# EAGLE design Grove - Multichannel Gas Sensor v1.0 (EAGLE 7.1.0)

## Sheet 1 of 2
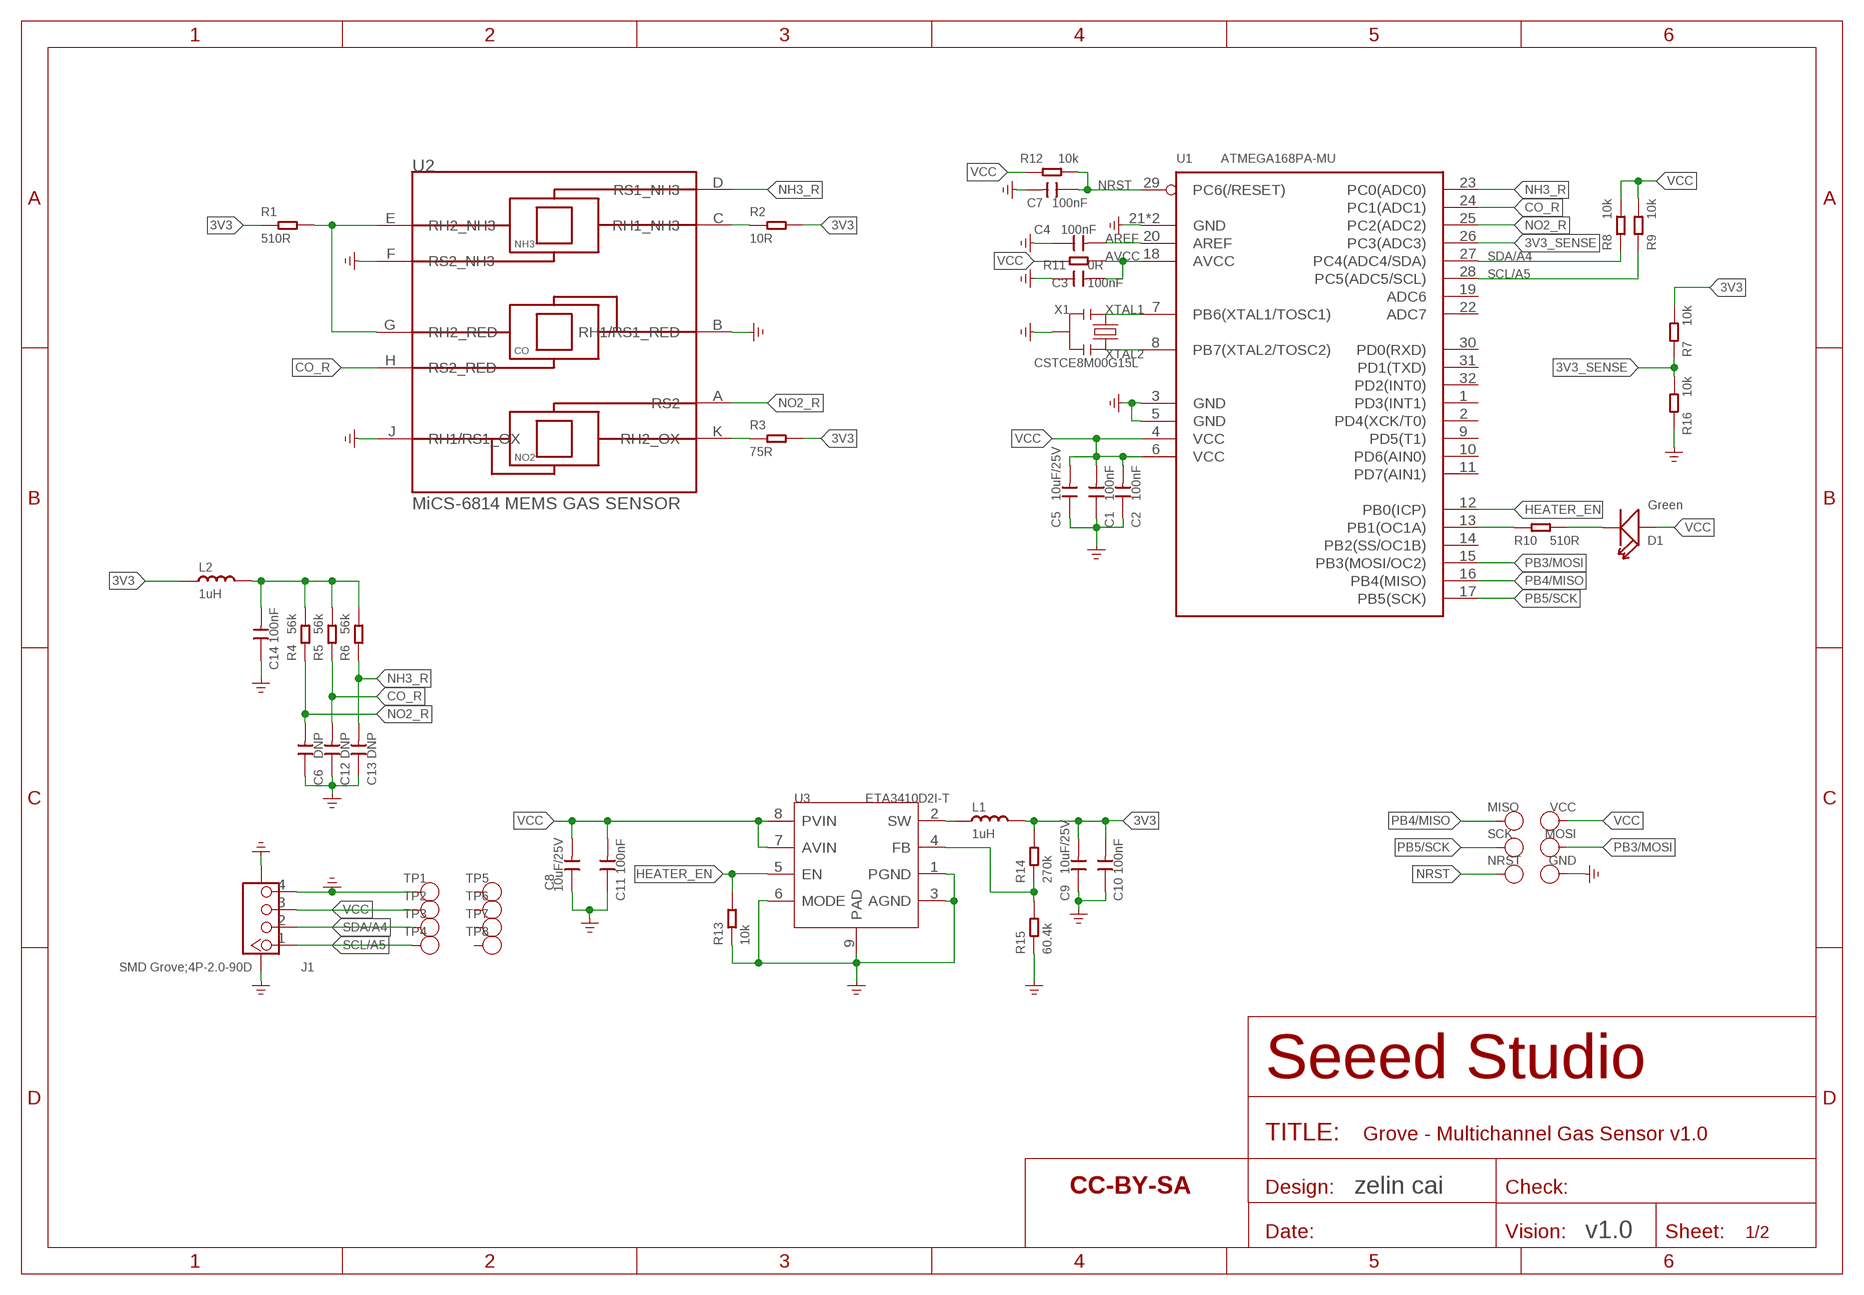
[diagram p0: schematic, sheet 1]

### Parts
C1  100nF  CAP-0402  [C0402]
C2  100nF  CAP-0402  [C0402]
C3  100nF  CAP-0402  [C0402]
C4  100nF  CAP-0402  [C0402]
C5  10uF/25V  CAP-0805  [C0805]
C6  DNP  CAP-0402  [C0402]
C7  100nF  CAP-0402  [C0402]
C8  10uF/25V  CAP-0805  [C0805]
C9  10uF/25V  CAP-0805  [C0805]
C10  100nF  CAP-0402  [C0402]
C11  100nF  CAP-0402  [C0402]
C12  DNP  CAP-0402  [C0402]
C13  DNP  CAP-0402  [C0402]
C14  100nF  CAP-0402  [C0402]
D1  Green  LED'0402'  [LED-0402]
GND  GND  TEST-POINT'4545'  [TP-D45MIL]
J1  SMD Grove;4P-2.0-90D  GROVE-CONNECTOR-SMD'90D'  [HW4-SMD-2.0-90D]
L1  1uH  INDUCTOR/FERRITE-BEAD'0603'  [L0603]
L2  1uH  INDUCTOR/FERRITE-BEAD'0603'  [L0603]
MISO  MISO  TEST-POINT'4545'  [TP-D45MIL]
MOSI  MOSI  TEST-POINT'4545'  [TP-D45MIL]
NRST  NRST  TEST-POINT'4545'  [TP-D45MIL]
R1  510R  RES-0402  [R0402]
R2  10R  RES-0402  [R0402]
R3  75R  RES-0402  [R0402]
R4  56k  RES-0402  [R0402]
R5  56k  RES-0402  [R0402]
R6  56k  RES-0402  [R0402]
R7  10k  RES-0402  [R0402]
R8  10k  RES-0402  [R0402]
R9  10k  RES-0402  [R0402]
R10  510R  RES-0402  [R0402]
R11  0R  RES-0402  [R0402]
R12  10k  RES-0402  [R0402]
R13  10k  RES-0402  [R0402]
R14  270k  RES-0402  [R0402]
R15  60.4k  RES-0402  [R0402]
R16  10k  RES-0402  [R0402]
SCK  SCK  TEST-POINT'4545'  [TP-D45MIL]
TP1  GND  TEST-POINT'4545'  [TP-D45MIL]
TP2  VCC  TEST-POINT'4545'  [TP-D45MIL]
TP3  SDA  TEST-POINT'4545'  [TP-D45MIL]
TP4  SCL  TEST-POINT'4545'  [TP-D45MIL]
TP5  NC  TEST-POINT'4545'  [TP-D45MIL]
TP6  NC  TEST-POINT'4545'  [TP-D45MIL]
TP7  NC  TEST-POINT'4545'  [TP-D45MIL]
TP8  NC  TEST-POINT'4545'  [TP-D45MIL]
U1  ATMEGA168PA-MU  MCU-ATMEGA8/168/328MU  [QFN32G-0.5-5X5MM]
U2  MiCS-6814  MICS-6814  [MICS-6814]
U3  ETA3410D2I-T  CONVERTER-ETA3410  [DFN8G-0.5-2X2MM]
U$1  Xadow-Multichanel Gas Sensor  SEEEDSTUDIO-OPEN-SCH-FRAME  [SEEEDSTUDIO-PCB-FRAME]
VCC  VCC  TEST-POINT'4545'  [TP-D45MIL]
X1  CSTCE8M00G15L  CRYSTAL-RESONATOR'SMD'  [RESONATOR3-SMD-3.6X1.3X0.8MM]

### Nets
3V3: C9.2 C10.2 L1.2 L2.1 R1.1 R2.2 R3.2 R7.1 R14.2
3V3_SENSE: R7.2 R16.1 U1.26(PC3(ADC3))
AREF: C4.2 U1.20(AREF)
AVCC: C3.2 R11.2 U1.18(AVCC)
CO_R: C12.2 R5.1 U1.24(PC1(ADC1)) U2.H(RS2_RED)
GND: C1.1 C2.1 C3.1 C4.1 C5.1 C6.1 C7.2 C8.1 C9.1 C10.1 C11.1 C12.1 C13.1 C14.1 GND.T J1.4 J1.SS1 J1.SS2 R13.1 R15.1 R16.2 TP1.T U1.3(GND) U1.5(GND) U1.21(GND) U1.33(GND) U2.B(RH1/RS1_RED) U2.F(RS2_NH3) U2.J(RH1/RS1_OX) U3.1(PGND) U3.3(AGND) U3.6(MODE) U3.9(PAD) X1.2 ; supply symbol labelled GND_POWER
HEATER_EN: R13.2 U1.12(PB0(ICP)) U3.5(EN)
N$1: R1.2 U2.E(RH2_NH3) U2.G(RH2_RED)
N$2: R2.1 U2.C(RH1_NH3)
N$3: R10.1 U1.13(PB1(OC1A))
N$4: R3.1 U2.K(RH2_OX)
N$5: D1.- R10.2
N$6: C14.2 L2.2 R4.2 R5.2 R6.2
N$7: L1.1 U3.2(SW)
N$9: R14.1 R15.2 U3.4(FB)
NH3_R: C13.2 R6.1 U1.23(PC0(ADC0)) U2.D(RS1_NH3)
NO2_R: C6.2 R4.1 U1.25(PC2(ADC2)) U2.A(RS2)
NRST: C7.1 NRST.T R12.1 U1.29(PC6(/RESET))
PB3/MOSI: MOSI.T U1.15(PB3(MOSI/OC2))
PB4/MISO: MISO.T U1.16(PB4(MISO))
PB5/SCK: SCK.T U1.17(PB5(SCK))
SCL/A5: J1.1 R9.2 TP4.T U1.28(PC5(ADC5/SCL))
SDA/A4: J1.2 R8.2 TP3.T U1.27(PC4(ADC4/SDA))
VCC: C1.2 C2.2 C5.2 C8.2 C11.2 D1.+ J1.3 R8.1 R9.1 R11.1 R12.2 TP2.T U1.4(VCC) U1.6(VCC) U3.7(AVIN) U3.8(PVIN) VCC.T
XTAL1: U1.7(PB6(XTAL1/TOSC1)) X1.1
XTAL2: U1.8(PB7(XTAL2/TOSC2)) X1.3
Unconnected: TP5.T TP6.T TP7.T TP8.T U1.1(PD3(INT1)) U1.2(PD4(XCK/T0)) U1.9(PD5(T1)) U1.10(PD6(AIN0)) U1.11(PD7(AIN1)) U1.14(PB2(SS/OC1B)) U1.19(ADC6) U1.22(ADC7) U1.30(PD0(RXD)) U1.31(PD1(TXD)) U1.32(PD2(INT0))

### Notes on the sheet
- zelin cai
- v1.0

## Sheet 2 of 2

## Library data of the parts
C1-C4 C6 C7 C10-C14 = Discrete-new:CAP: Ceramic Capacitors; PN: 302010004
C5 C8 C9 = Discrete-new:CAP: Ceramic Capacitors; PN: 302010178
D1 = Discrete-new:LED; PN: 304090121
GND MISO MOSI NRST SCK TP1-TP8 VCC = Discrete-new:TEST-POINT; PARTNO: DNP
J1 = Connector-new:GROVE-CONNECTOR-SMD: 4P-SMD-2.0:320110030;4P-SMD-2.0-90D:320110032; PN: 320110032
L1 = Discrete-new:INDUCTOR/FERRITE-BEAD; PN: 303010110
L2 = Discrete-new:INDUCTOR/FERRITE-BEAD; PN: 303030001
R1 R10 = Discrete-new:RES; PN: 301010050
R2 = Discrete-new:RES; PN: 301010444
R3 = Discrete-new:RES; PN: 301010058
R4-R6 = Discrete-new:RES; PN: 301010032
R7-R9 R12 R13 R16 = Discrete-new:RES; PN: 301010047
R11 = Discrete-new:RES; PN: 301010000
R14 = Discrete-new:RES; PN: 301010666
R15 = Discrete-new:RES; PN: 301010669
U1 = IC-new:MCU-ATMEGA8/168/328; PN: 310010072
U2 = template:MICS-6814: SGX SensorTech MiCS-6814 MEMS Gas Sensor w/3 Indepedent Sensing Elements; PN: 314100015
U3 = template:CONVERTER-ETA3410: 3MHZ 2A High Step-Down Converter in DFN2x2-8L Package; PN: 310030161
U$1 = moudle-new:SEEEDSTUDIO-OPEN-SCH-FRAME
X1 = Discrete-new:CRYSTAL-RESONATOR: Resonator Small SMD resonator. This is the itty bitty 10/20MHz resonators with built in caps. CSTCE10M0G55 and CSTCE20M0V53. Footprint has been reviewed closely but hasn't been tested yet.; PN: 306030005

## Board
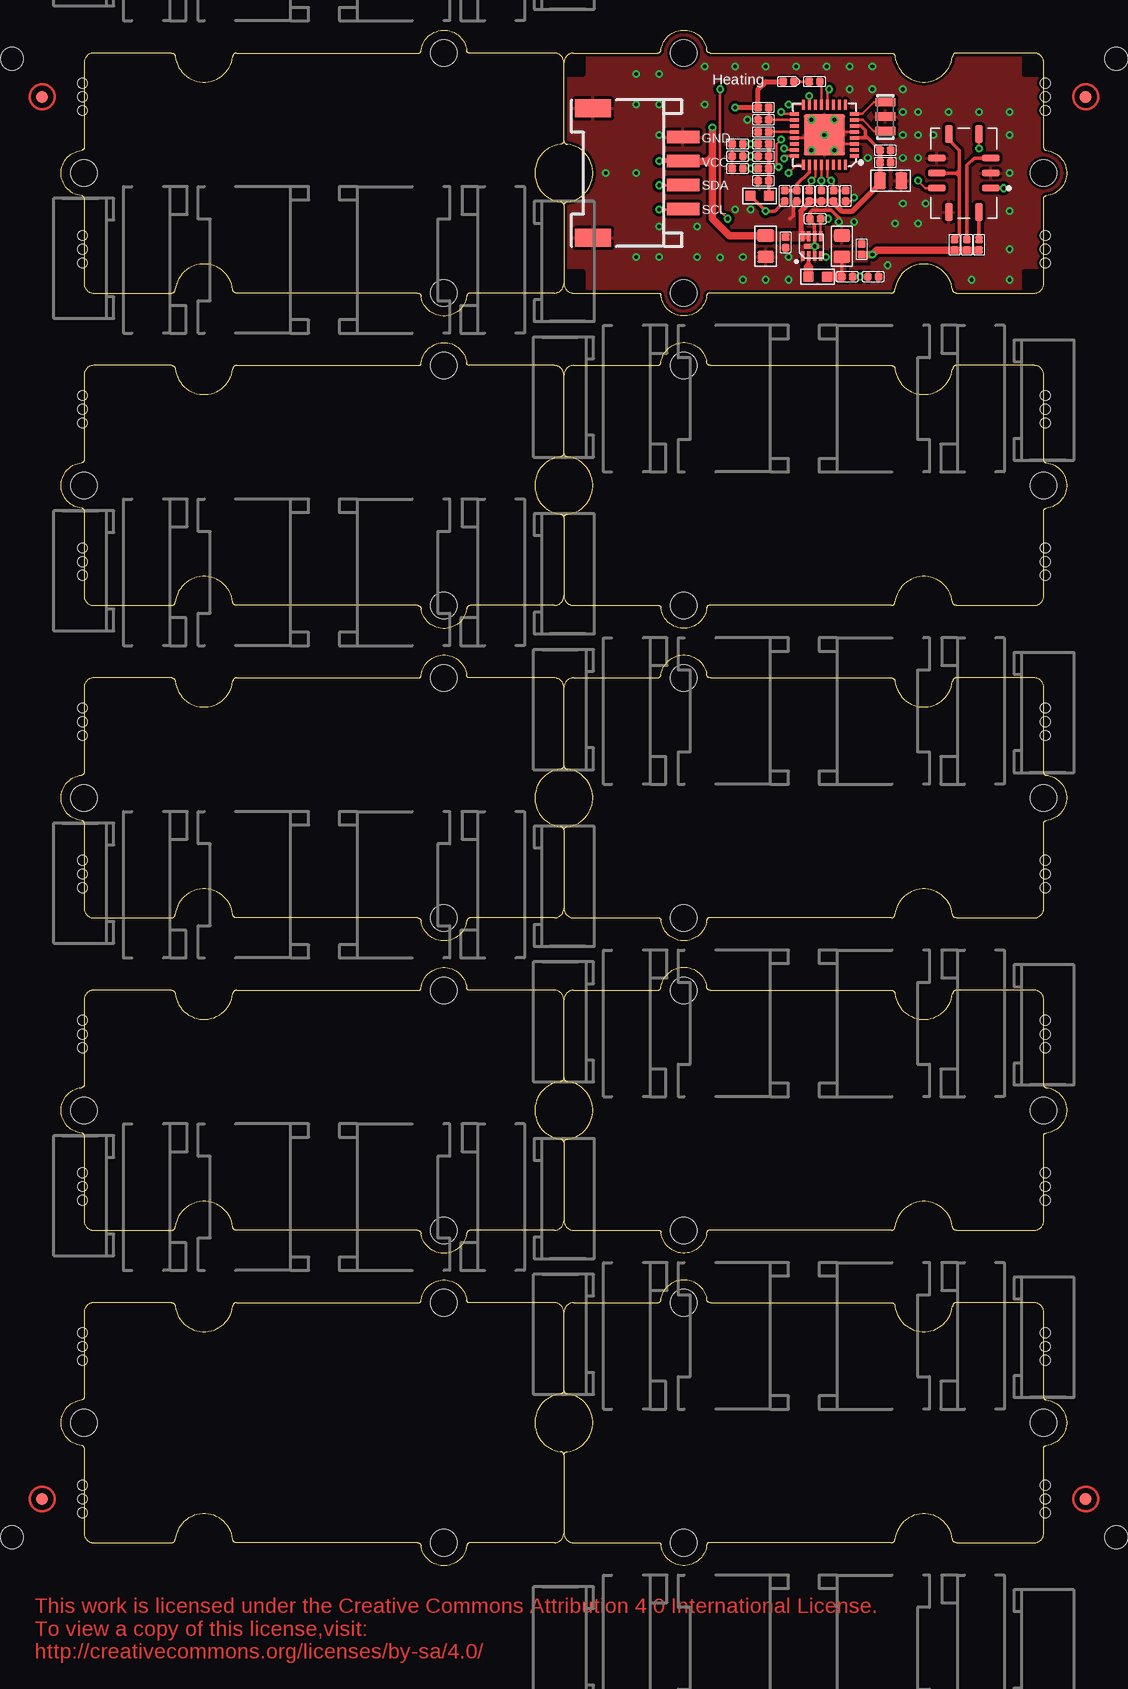
[diagram p1: board, top side]
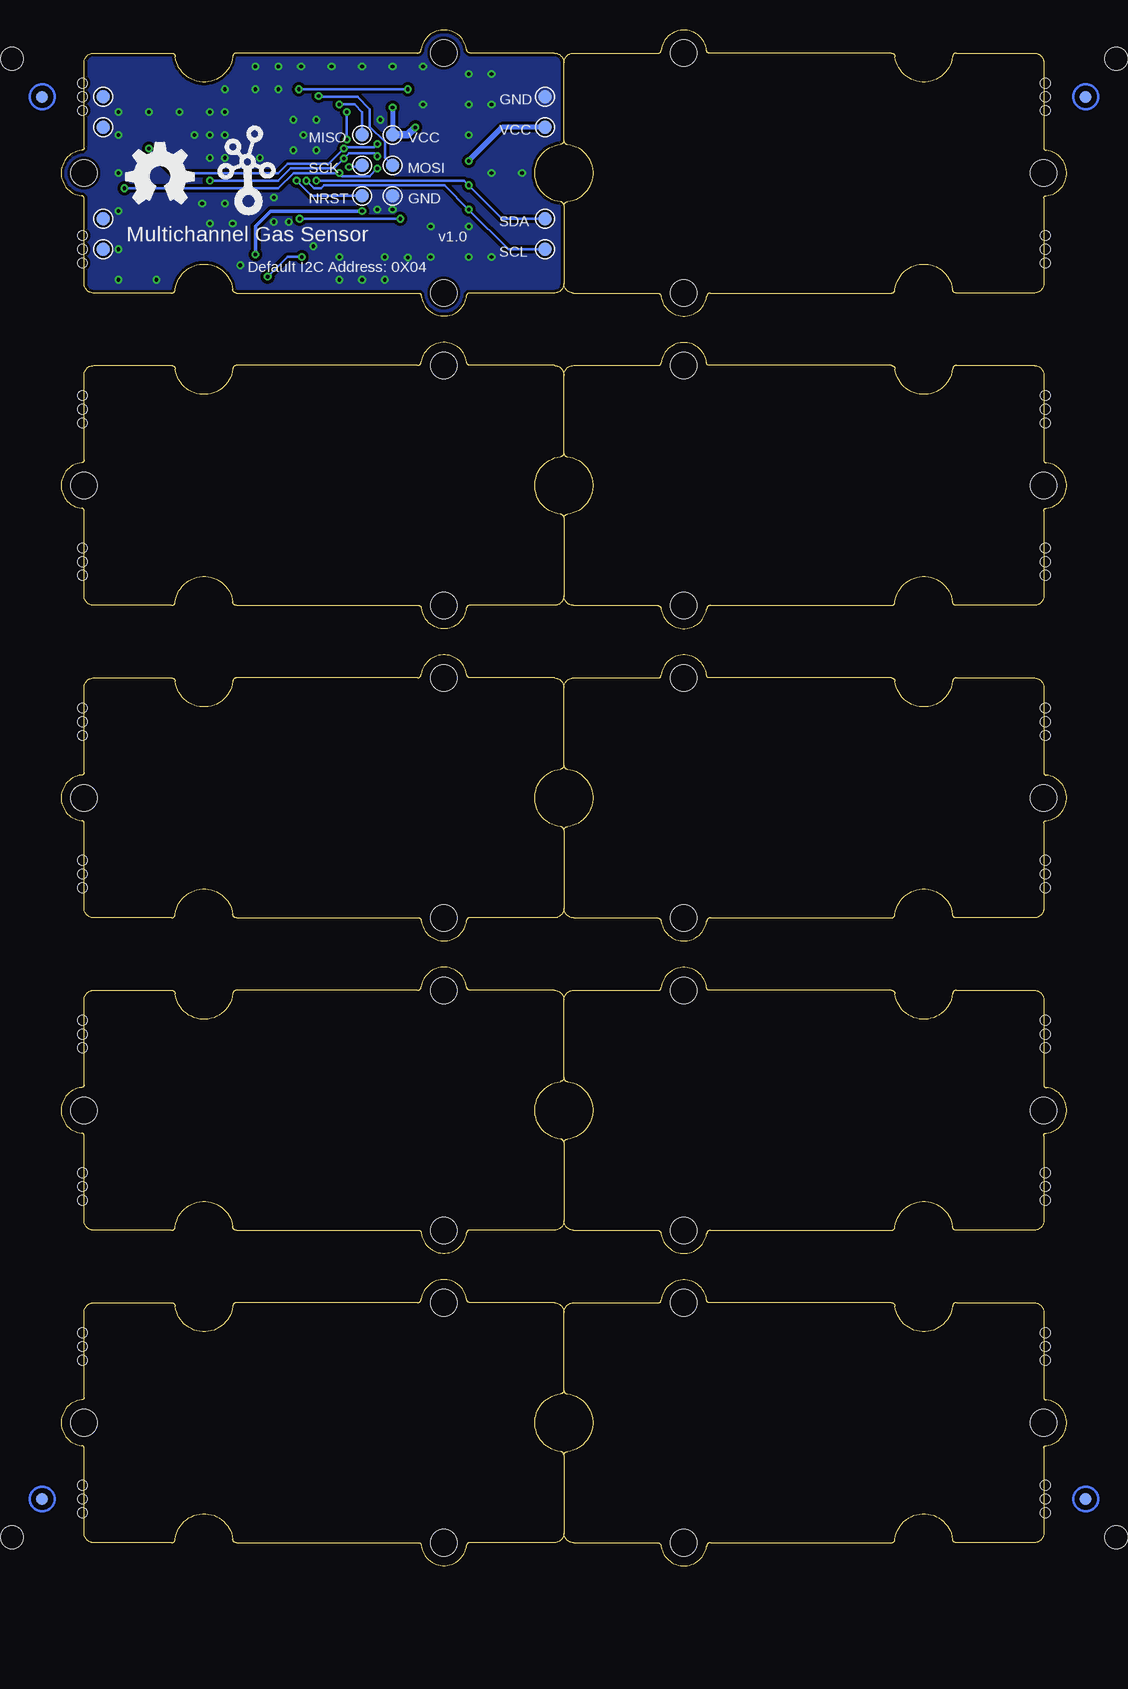
[diagram p2: board, bottom side, seen from below]

Size 83.82 x 127.98 mm. Coordinates in mm from the lower left corner, seen from the top.
Copper layers (1*16): Top 0.035mm / dielectric 1.5mm / Bottom 0.035mm
Design rules "SeeedStudio_2layer_DRU_no_angle_20140221 *": minimum track width 6mil, minimum drill 12mil, track to track 6mil, track to pad 6mil, pad to pad 6mil, via to via 6mil, smd to smd 0mil, copper to edge 10mil, drill to drill 10mil, minimum pad ring 10mil, minimum via ring 6mil, stop-mask expansion 2mil, vias tented up to drill 25mil, thermal gap 10mil
Holes 0.8 mm at 1.78,123.55 1.78,121.27 1.78,122.41 1.78,110.85 1.78,108.57 1.78,109.71 1.78,97.52 1.78,95.23 1.78,96.38 1.78,84.82 1.78,82.53 1.78,83.68 1.78,71.48 1.78,69.2 1.78,70.34 1.78,58.78 1.78,56.5 1.78,57.64 1.78,45.45 1.78,43.16 1.78,44.31 1.78,32.75 1.78,30.46 1.78,31.61 1.78,19.41 1.78,17.13 1.78,18.27 1.78,6.71 1.78,4.43 1.78,5.57 82.04,121.27 82.04,123.55 82.04,122.41 82.04,108.57 82.04,110.85 82.04,109.71 82.04,95.23 82.04,97.52 82.04,96.38 82.04,82.53 82.04,84.82 82.04,83.68 82.04,69.2 82.04,71.48 82.04,70.34 82.04,56.5 82.04,58.78 82.04,57.64 82.04,43.16 82.04,45.45 82.04,44.31 82.04,30.46 82.04,32.75 82.04,31.61 82.04,17.13 82.04,19.41 82.04,18.27 82.04,4.43 82.04,6.71 82.04,5.57
Holes 1.91 mm at -4.13,2.4 87.95,2.4 87.95,125.59 -4.13,125.59

### Footprints (pad centres in the part's own frame; a part is rotated, then mirrored left to right if it is on the bottom)
C0402 = smd 0.635 x 0.635: 1 0,0.445; 2 0,-0.445
C0805 = smd 1.397 x 1.016: 1 0,0.889; 2 0,-0.889
LED-0402 = smd 0.635 x 0.635: + -0.445,0; - 0.445,0
TP-D45MIL = smd 1.143 x 1.143: T 0,0
HW4-SMD-2.0-90D = smd 1.01 x 2.74: 1 -3,-0.1; 2 -1,-0.1; 3 1,-0.1; 4 3,-0.1 | smd 1.5 x 3: SS1 -5.4,7.4; SS2 5.4,7.4
L0603 = smd 0.889 x 0.889: 1 -0.762,0; 2 0.762,0
ROUND-MARK-1.0 = smd 1.016 x 1.016: P$1 0,0
R0402 = smd 0.635 x 0.635: 1 0,0.445; 2 0,-0.445
QFN32G-0.5-5X5MM = smd 0.813 x 0.279: 1 -2.5,1.75; 2 -2.5,1.25; 3 -2.5,0.75; 4 -2.5,0.25; 5 -2.5,-0.25; 6 -2.5,-0.75; 7 -2.5,-1.25; 8 -2.5,-1.75; 17 2.5,-1.75; 18 2.5,-1.25; 19 2.5,-0.75; 20 2.5,-0.25; 21 2.5,0.25; 22 2.5,0.75; 23 2.5,1.25; 24 2.5,1.75 | smd 0.279 x 0.813: 9 -1.75,-2.5; 10 -1.25,-2.5; 11 -0.75,-2.5; 12 -0.25,-2.5; 13 0.25,-2.5; 14 0.75,-2.5; 15 1.25,-2.5; 16 1.75,-2.5; 25 1.75,2.5; 26 1.25,2.5; 27 0.75,2.5; 28 0.25,2.5; 29 -0.25,2.5; 30 -0.75,2.5; 31 -1.25,2.5; 32 -1.75,2.5 | smd 3.429 x 3.429: 33 0,0
MICS-6814 = smd 1.5 x 0.6: A 2.25,-1.25; B 2.25,0; C 2.25,1.25; F -2.25,1.25; G -2.25,0; H -2.25,-1.25 | smd 0.6 x 1.5: D 1.25,3.25; E -1.25,3.25; J -1.25,-3.25; K 1.25,-3.25
DFN8G-0.5-2X2MM = smd 0.8 x 0.3: 1 -0.827,0.75; 2 -0.827,0.25; 3 -0.827,-0.25; 4 -0.827,-0.75; 5 0.827,-0.75; 6 0.827,-0.25; 7 0.827,0.25; 8 0.827,0.75 | smd 0.45 x 1.3: 9 0,0
GROVE-TEST-PLATFORM = hole 2.2: -10,-10; -10,10; 20,0
GROVE-1*2-TEST-PLATFORM = hole 2.2: -10,-10; -10,10; 20,0
RESONATOR3-SMD-3.6X1.3X0.8MM = smd 0.7 x 1.7: 1 -1.2,0; 2 0,0; 3 1.2,0

### Placement (x,y rotation side)
C1  68.71,116.95 270 top
C2  68.71,117.97 270 top
C3  58.55,120.51 90 top
C4  58.55,119.49 90 top
C5  69.15,115.43 270 top
C6  56.39,116.44 90 top
C7  65.41,114.16 0 top
C8  58.74,109.97 180 top
C9  65.09,109.97 0 top
C10  66.74,109.71 0 top
C11  60.39,110.28 180 top
C12  56.39,117.46 90 top
C13  56.39,118.47 90 top
C14  58.55,115.43 90 top
D1  60.64,123.68 0 top
GND  56.2,114.16 0 bottom
J1  51.75,116.06 90 top
L1  63.06,107.43 0 top
L2  58.23,114.16 0 top
MISO  58.74,119.24 0 bottom
MOSI  56.2,116.7 0 bottom
NRST  58.74,114.16 0 bottom
P1  [ROUND-MARK-1.0]  -1.59,5.57 0 top
P2  [ROUND-MARK-1.0]  85.41,5.57 0 top
P3  [ROUND-MARK-1.0]  -1.59,122.41 0 top
P4  [ROUND-MARK-1.0]  85.41,122.41 0 top
P5  [ROUND-MARK-1.0]  -1.59,5.57 0 bottom
P6  [ROUND-MARK-1.0]  85.41,5.57 0 bottom
P7  [ROUND-MARK-1.0]  85.41,122.41 0 bottom
P8  [ROUND-MARK-1.0]  -1.59,122.41 0 bottom
R1  74.49,110.09 180 top
R2  75.5,110.09 0 top
R3  76.52,110.09 0 top
R4  58.55,116.44 90 top
R5  58.55,117.46 90 top
R6  58.55,118.47 90 top
R7  60.33,114.16 180 top
R8  62.36,114.16 180 top
R9  63.37,114.16 180 top
R10  62.8,123.68 270 top
R11  58.55,121.52 90 top
R12  64.39,114.16 0 top
R13  62.87,112.25 90 top
R14  65.53,107.43 270 top
R15  67.69,107.43 270 top
R16  61.34,114.16 0 top
SCK  58.74,116.7 0 bottom
TP1  43.5,122.41 0 bottom
TP2  43.5,119.87 0 bottom
TP3  43.5,112.25 0 bottom
TP4  43.5,109.71 0 bottom
TP5  80.33,122.41 0 bottom
TP6  80.33,119.87 0 bottom
TP7  80.33,112.25 0 bottom
TP8  80.33,109.71 0 bottom
U1  63.63,119.24 180 top
U2  75.25,116.06 0 top
U3  62.55,109.97 90 top
U4  [GROVE-TEST-PLATFORM]  61.91,37.96 0 top
U5  [GROVE-TEST-PLATFORM]  21.91,37.96 180 top
U6  [GROVE-TEST-PLATFORM]  61.91,63.99 0 top
U7  [GROVE-TEST-PLATFORM]  21.91,63.99 180 top
U8  [GROVE-TEST-PLATFORM]  61.91,90.03 0 top
U9  [GROVE-TEST-PLATFORM]  21.91,90.03 180 top
U10  [GROVE-TEST-PLATFORM]  21.91,116.06 180 top
U12  [GROVE-TEST-PLATFORM]  61.91,11.92 0 top
U13  [GROVE-TEST-PLATFORM]  21.91,11.92 180 top
U$1  -2.22,-7.76 0 top  (outside the outline)
U$23  [GROVE-1*2-TEST-PLATFORM]  61.91,116.06 0 top
U$24  [OSHW_FILLX200_NOTEXT]  78.42,113.52 0 bottom
U$25  [GROVE-SILK-BIG]  68.26,113.52 0 bottom
VCC  56.2,119.24 0 bottom
X1  68.71,120.76 90 top

### Tracks (layer width: path | path; a pad name or v marks a point on that pad's centre or on a via)
3V3  (via drill 0.3 pad 0.64)
  Top 0.305: L2.1 v58.74,112.89 59.5,112.89 R7.1 | 64.96,107.43 R14.2 C9.2
  Top 0.61: R3.2 R2.2 R1.1 68.01,109.65 v67.63,109.27 C10.2
  Top 0.813: 64.96,107.43 L1.2
  Bottom 0.305: v58.74,112.89 66.36,112.89 67.63,111.62 v67.63,109.27 | v67.63,109.27 | v67.63,109.27
  pour Top (no thermals): 64.39,109.52 67.12,109.52 67.12,108.7 65.34,108.7 65.34,107.11 64.39,107.11
3V3_SENSE
  Top 0.305: R7.2 R16.1 61.34,115.11 62.38,116.15 U1.26
AREF
  Top 0.203: U1.20 C4.2
AVCC
  Top 0.203: U1.18 59.01,120.49 C3.2 R11.2
CO_R  (via drill 0.3 pad 0.64)
  Top 0.203: R5.1 v57.47,117.46 C12.2 | U1.24 60.48,117.49 v60.26,117.27 | U2.H 72.05,114.81 v71.44,115.43
  Bottom 0.203: v57.47,117.46 57.72,117.71 59.82,117.71 v60.26,117.27 61.09,116.44 64.71,116.44 65.72,115.43 v71.44,115.43
GND  (via drill 0.3 pad 0.64)
  Top 0.203: U1.21 63.57,118.99 | U1.5 64.07,119.49 63.57,118.99 | U1.3 64.38,118.49 U1.33 63.57,119.18 63.57,118.99 | C7.2 65.79,113.71 v66.1,114.03
  Top 0.305: 62.8,110.09 U3.6 62.8,111.75 62.55,112 62.55,112.12 R13.1 62.42,112.76 62.61,112.95 64.2,112.95 64.9,112.25 | 62.8,110.09 62.68,109.97 | U3.3 62.8,110.09 | R16.2 61.02,113.39 61.02,112.51 60.77,112.25
  other vias: 67.25,117.33 67.63,123.05 62.55,120.51 64.45,120.51 64.45,117.97 62.55,117.97 63.63,119.24 56.2,113.01 53.02,111.62 71.44,111.87 70.17,113.52 54.93,109.01 68.9,108.38 69.53,111.87 73.98,121.14 79.06,116.06 79.06,112.89 79.06,119.24 72.71,119.24 71.44,117.33 70.17,117.33 70.17,119.24 70.17,121.14 70.17,123.05 56.83,109.08 57.21,120.51 47.94,121.78 49.85,111.62 49.85,119.24 53.66,121.78 49.85,121.78 49.85,124.32 53.66,124.95 56.2,124.95 65.72,123.05 65.72,124.95 67.63,124.95 53.02,109.08 49.85,109.08 47.94,109.08 47.94,116.06 47.94,124.32 45.4,116.06 79.06,109.71 79.06,107.17 75.88,107.17 71.44,121.14 76.52,121.14 79.06,121.14 72.07,113.52 71.44,119.24 62.8,109.97 58.74,107.17 57.47,113.01 64.83,112 66.1,112 60.64,109.08 60.64,107.17 56.83,107.17 58.74,124.95 61.28,124.95 63.82,124.95
  pour Top (isolate 0.254, rank 6): 41.59,128.13 84.14,128.13 84.14,104 41.59,104
  pour Bottom (isolate 0.254, rank 6): 41.59,128.13 84.14,128.13 84.14,104 41.59,104
HEATER_EN  (via drill 0.3 pad 0.64)
  Top 0.203: U1.12 63.88,122.92 v64.01,123.05 | U3.5 63.3,112.24 | v54.93,123.05 54.93,112.89 v55.56,112.25 | v63.95,112.25 R13.2
  Top 0.305: 63.3,112.24 R13.2
  Bottom 0.203: v64.01,123.05 v54.93,123.05 | v55.56,112.25 v63.95,112.25
N$1
  Top 0.305: U2.E 74,118.84 74.87,117.97 74.87,116.32 | 74.87,116.32 74.87,116.06 | 74.87,115.81 74.87,110.92 R1.2 | U2.G 74.61,116.06 | 74.61,116.06 74.87,116.06 | 74.61,116.06 74.87,116.32 | 74.61,116.06 74.87,115.81 | 74.87,115.81 74.87,116.06
N$2
  Top 0.305: U2.C 76.12,117.31 75.5,116.7 R2.1
N$3
  Top 0.203: U1.13 63.38,123.81 | 63.38,123.81 63.38,123.87 | R10.1 63.38,123.81
N$4
  Top 0.305: U2.K 76.5,110.56 R3.1
N$5
  Top 0.203: R10.2 D1.-
N$6
  Top 0.305: R6.2 R5.2 R4.2 C14.2 L2.2
N$7
  Top 0.203: 62.3,107.68 L1.1
  Top 0.305: U3.2 62.3,108.57 62.29,108.57 | 62.04,108.31 62.29,108.57 | 62.29,108.57 62.55,108.31 62.55,107.43 L1.1 | 62.04,108.31 62.04,107.43 62.17,107.3 62.17,107.43 62.29,107.55 62.29,108.31 62.04,108.31
N$9  (via drill 0.3 pad 0.64)
  Top 0.203: R15.2 v66.61,107.43 R14.1 | 63.31,109.13 U3.4 63.36,109.08 v63.75,109.08
  Bottom 0.203: v66.61,107.43 64.96,109.08 v63.75,109.08
NH3_R  (via drill 0.3 pad 0.64)
  Top 0.203: C13.2 v57.47,118.47 R6.1 | U1.23 60.37,117.99 v60.26,118.09 | v76.52,118.09 76.52,119.29 U2.D
  Bottom 0.203: v57.47,118.47 57.72,118.22 60.14,118.22 v60.26,118.09 61.53,116.82 64.96,116.82 65.72,116.06 74.49,116.06 v76.52,118.09
NO2_R  (via drill 0.3 pad 0.64)
  Top 0.203: C6.2 v57.47,116.44 R4.1 | U1.25 61.32,116.74 v60.64,116.06 | v78.55,114.79 77.48,114.79 U2.A
  Bottom 0.203: v57.47,116.44 58.1,115.81 60.39,115.81 v60.64,116.06 64.45,116.06 65.72,114.79 v78.55,114.79
NRST  (via drill 0.3 pad 0.64)
  Top 0.203: C7.1 R12.1 64.39,115.24 v64.2,115.43 63.88,115.75 U1.29
  Bottom 0.203: NRST.T 62.93,114.16 v64.2,115.43
PB3/MOSI  (via drill 0.3 pad 0.64)
  Top 0.203: U1.15 62.38,122.46 v62.36,122.47
  Bottom 0.203: MOSI.T 56.83,117.33 56.83,118.66 58.1,119.93 58.1,121.4 59.12,122.41 62.29,122.41 v62.36,122.47
PB4/MISO  (via drill 0.3 pad 0.64)
  Top 0.203: v60.64,121.78 61.84,121.78 U1.16
  Bottom 0.203: MISO.T 58.74,121.14 59.37,121.78 v60.64,121.78
PB5/SCK  (via drill 0.3 pad 0.64)
  Top 0.203: 60.14,121.01 v60.01,121.14 60.16,120.99 U1.17 | v60.01,118.86 59.63,118.47 59.63,116.76 v59.82,116.57
  Bottom 0.203: v60.01,118.86 v60.01,121.14 | v59.82,116.57 58.87,116.57 SCK.T
SCL/A5  (via drill 0.3 pad 0.64)
  Top 0.203: U1.28 v63.38,115.42 R9.2 | 51.87,113.08 J1.1 51.81,113.01 v49.85,113.01
  Bottom 0.203: v63.38,115.42 62.75,114.79 62.17,114.79 61.91,115.05 51.88,115.05 v49.85,113.01 46.55,109.71 TP4.T
SDA/A4  (via drill 0.3 pad 0.64)
  Top 0.203: U1.27 62.88,115.76 v62.55,115.43 62.36,115.24 R8.2 | 52.22,115.43 51.99,115.19 | 51.99,115.19 J1.2 51.84,115.05 v49.85,115.05 | 52.13,115.05 51.99,115.19
  Bottom 0.203: v62.55,115.43 50.23,115.43 v49.85,115.05 47.05,112.25 TP3.T
VCC  (via drill 0.3 pad 0.64)
  Top 0.203: 51.84,117.08 J1.3
  Top 0.305: U1.4 67.06,118.99 | 67.06,118.99 67.24,118.99 | 67.24,118.99 C2.2 | U1.6 66.69,119.99 67.06,119.62 67.06,118.99 | 67.24,118.99 67.12,119.11 66.99,119.11 66.93,119.05
  Top 0.406: C2.2 C1.2 C5.2 68.01,115.17 68.01,114.92 65.98,112.89 65.09,112.89 64.39,113.58 R12.2 R9.1 R8.1 62.36,113.58 61.66,112.89 61.66,110.93 U3.8 | v56.2,121.52 R11.1 58.1,123.05 58.74,123.68 D1.+ | 51.84,117.08 v49.85,117.08
  Top 0.61: 54.29,116.7 54.29,117.08 | 54.29,117.08 54.29,117.46 | 54.29,117.46 v54.29,119.87 | J1.3 53.9,117.06 | 53.93,117.06 54.28,117.06 54.29,117.08 | 53.9,117.06 54.29,117.46 | 53.9,117.06 53.93,117.06 | 53.93,117.06 54.29,116.7 | 61.91,110.85 61.86,110.85 U3.8 | C8.2 55.69,110.85 54.29,112.25 54.29,116.7
  Bottom 0.406: v56.2,121.52 VCC.T | TP2.T 47.05,119.87 v49.85,117.08
  Bottom 0.61: VCC.T 54.93,119.24 v54.29,119.87
  pour Top (isolate 0.254, no thermals): 59.37,110.47 62.36,110.47 62.36,111.11 59.37,111.11
XTAL1
  Top 0.203: U1.7 66.82,120.49 67.75,119.56 X1.1
XTAL2
  Top 0.203: U1.8 66.78,120.99 67.75,121.96 X1.3

### Text on the board
tPlace: Heating | GND | VCC | SDA | SCL
bPlace: GND | VCC | SDA | v1.0 | Multichannel Gas Sensor | SCL | Default I2C Address: 0X04